# EAGLE design vr-glove-circuit-sch (EAGLE 7.2.0)
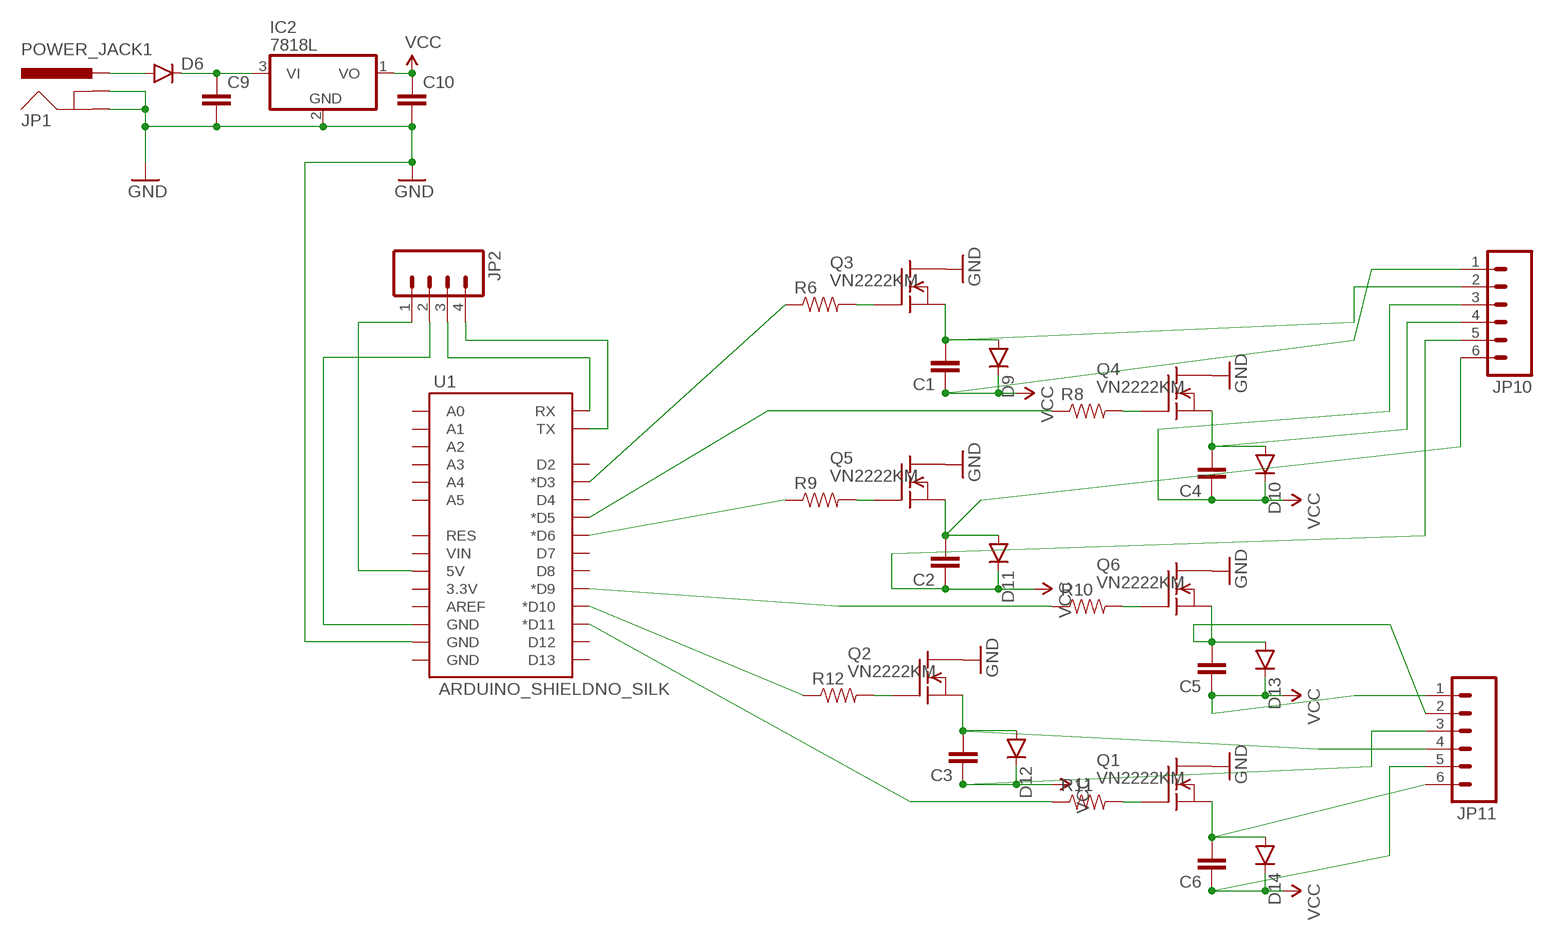
[diagram p0: schematic, sheet 1]

## Parts
C1  CAPPTH  [CAP-PTH-SMALL]
C2  CAPPTH  [CAP-PTH-SMALL]
C3  CAPPTH  [CAP-PTH-SMALL]
C4  CAPPTH  [CAP-PTH-SMALL]
C5  CAPPTH  [CAP-PTH-SMALL]
C6  CAPPTH  [CAP-PTH-SMALL]
C9  CAPPTH  [CAP-PTH-SMALL]
C10  CAPPTH  [CAP-PTH-SMALL]
D6  DIODE1N4148  [DIODE-1N4148]
D9  DIODE1N4148  [DIODE-1N4148]
D10  DIODE1N4148  [DIODE-1N4148]
D11  DIODE1N4148  [DIODE-1N4148]
D12  DIODE1N4148  [DIODE-1N4148]
D13  DIODE1N4148  [DIODE-1N4148]
D14  DIODE1N4148  [DIODE-1N4148]
IC2  7818L  [TO92]
JP1  POWER_JACK1  [POWER_JACK_SMD_OVERPASTE_REDBOARD_0603]
JP2  M04LOCK  [1X04_LOCK]
JP10  M06SILK_FEMALE_PTH  [1X06]
JP11  M06SILK_FEMALE_PTH  [1X06]
Q1  VN2222KM  [TO237]
Q2  VN2222KM  [TO237]
Q3  VN2222KM  [TO237]
Q4  VN2222KM  [TO237]
Q5  VN2222KM  [TO237]
Q6  VN2222KM  [TO237]
R6  RESISTORPTH-1/4W-VERT  [AXIAL-0.1]
R8  RESISTORPTH-1/4W-VERT  [AXIAL-0.1]
R9  RESISTORPTH-1/4W-VERT  [AXIAL-0.1]
R10  RESISTORPTH-1/4W-VERT  [AXIAL-0.1]
R11  RESISTORPTH-1/4W-VERT  [AXIAL-0.1]
R12  RESISTORPTH-1/4W-VERT  [AXIAL-0.1]
U1  ARDUINO_SHIELDNO_SILK  [DUEMILANOVE_VIAS]

## Nets
GND: C9.2 C10.2 IC2.2(GND) JP1.GND(GNDBREAK) JP1.P$4(GND) Q1.1(D) Q2.1(D) Q3.1(D) Q4.1(D) Q5.1(D) Q6.1(D) U1.GND@1(GND)
N$1: Q3.2(G) R6.P$2
N$2: C1.2 D9.A JP10.2 Q3.3(S)
N$3: JP2.2 U1.GND@2(GND)
N$4: Q5.2(G) R9.P$2
N$5: C2.2 D11.A JP10.6 Q5.3(S)
N$6: JP2.1 U1.5V
N$7: Q2.2(G) R12.P$2
N$8: C3.2 D12.A JP11.4 Q2.3(S)
N$9: D6.A JP1.VIN0(PWR)
N$10: Q4.2(G) R8.P$2
N$11: C4.2 D10.A JP10.4 Q4.3(S)
N$12: JP2.3 U1.RX
N$13: Q6.2(G) R10.P$2
N$14: C5.2 D13.A JP11.2 Q6.3(S)
N$15: JP2.4 U1.TX
N$16: Q1.2(G) R11.P$2
N$17: C6.2 D14.A JP11.6 Q1.3(S)
N$18: C9.1 D6.C IC2.3(VI)
N$19: R6.P$1 U1.D3(*D3)
N$20: R8.P$1 U1.D5(*D5)
N$21: R9.P$1 U1.D6(*D6)
N$22: R10.P$1 U1.D9(*D9)
N$23: R12.P$1 U1.D10(*D10)
N$24: R11.P$1 U1.D11(*D11)
VCC: C1.1 C2.1 C3.1 C4.1 C5.1 C6.1 C10.1 D9.C D10.C D11.C D12.C D13.C D14.C IC2.1(VO) JP10.1 JP10.3 JP10.5 JP11.1 JP11.3 JP11.5
Unconnected: U1.3.3V U1.A0 U1.A1 U1.A2 U1.A3 U1.A4 U1.A5 U1.AREF U1.D2 U1.D4 U1.D7 U1.D8 U1.D12 U1.D13 U1.GND@0(GND) U1.RES U1.VIN

## Library data of the parts
C1-C6 = SparkFun-Capacitors:CAP: Capacitor Standard 0603 ceramic capacitor, and 0.1" leaded capacitor.
C9 C10 = SparkFun-Passives:CAP: Capacitor Standard 0603 ceramic capacitor, and 0.1" leaded capacitor.
D6 D9-D14 = SparkFun-DiscreteSemi:DIODE: Diode These are standard reverse protection diodes and small signal diodes. SMA package can handle up to about 1A. SOD-323 can handle about 200mA. What the SOD-323 package when ordering, there are some mfgs out there that are 5-pin packages.
IC2 = linear:78*: Positive VOLTAGE REGULATOR Source: http://cache.national.com/ds/LM/LM78L05.pdf http://www.fairchildsemi.com/ds/LM/LM7805.pdf
JP1 = SparkFun-Connectors:POWER_JACK: Power Jack This is the standard 5.5mm barrel jack for power. The PTH is the most common, proven, reliable, footprint. The Slot footprint only works if the mill layer is transmitted to the PCB fab house so be warned. Mating wall wart : TOL-00298 (and others)
JP2 = SparkFun-Connectors:M04: Header 4 Standard 4-pin 0.1" header. Use with straight break away headers (SKU : PRT-00116), right angle break away headers (PRT-00553), swiss pins (PRT-00743), machine pins (PRT-00117), and female headers (PRT-00115). Molex polarized connector foot print use with SKU : PRT-08231 with associated crimp pins and housings. 1MM SMD Version SKU: PRT-10208
JP10 JP11 = SparkFun-Connectors:M06: Header 6 Standard 6-pin 0.1" header. Use with straight break away headers (SKU : PRT-00116), right angle break away headers (PRT-00553), swiss pins (PRT-00743), machine pins (PRT-00117), and female headers (PRT-00115). Molex polarized connector foot print use with SKU : PRT-08094 with associated crimp pins and housings. NOTES ON THE VARIANTS LOCK and LOCK_LONGPADS... This footprint was designed to help hold the alignment of a through-hole component (i.e. 6-pin header) while soldering it into place. You may notice that each hole has been shifted either up or down by 0.005 of an inch from it's more standard position (which is a perfectly straight line). This slight alteration caused the pins (the squares in the middle) to touch the edges of the holes. Because they are alternating, it causes a "brace" to hold the component in place. 0.005 has proven to be the perfect amount of "off-center" position when using our standard breakaway headers. Although looks a little odd when you look at the bare footprint, once you have a header in there, the alteration is very hard to notice. Also,if you push a header all the way into place, it is covered up entirely on the bottom side. This idea of altering the position of holes to aid alignment will be further integrated into the Sparkfun Library for other footprints. It can help hold any component with 3 or more connection pins.; PROD_ID: CONN-08437
Q1-Q6 = transistor-fet:VN2222KM: N-Channel Enhancement MOSFET (VMOS); 60V; 0,5A; 7,5Ohm
R6 R8-R12 = SparkFun-Resistors:RESISTOR: Resistor Basic schematic elements and footprints for 0603, 1206, and PTH resistors.
U1 = SparkFun-Boards:ARDUINO_SHIELD: Arduino shield footprint

## Board
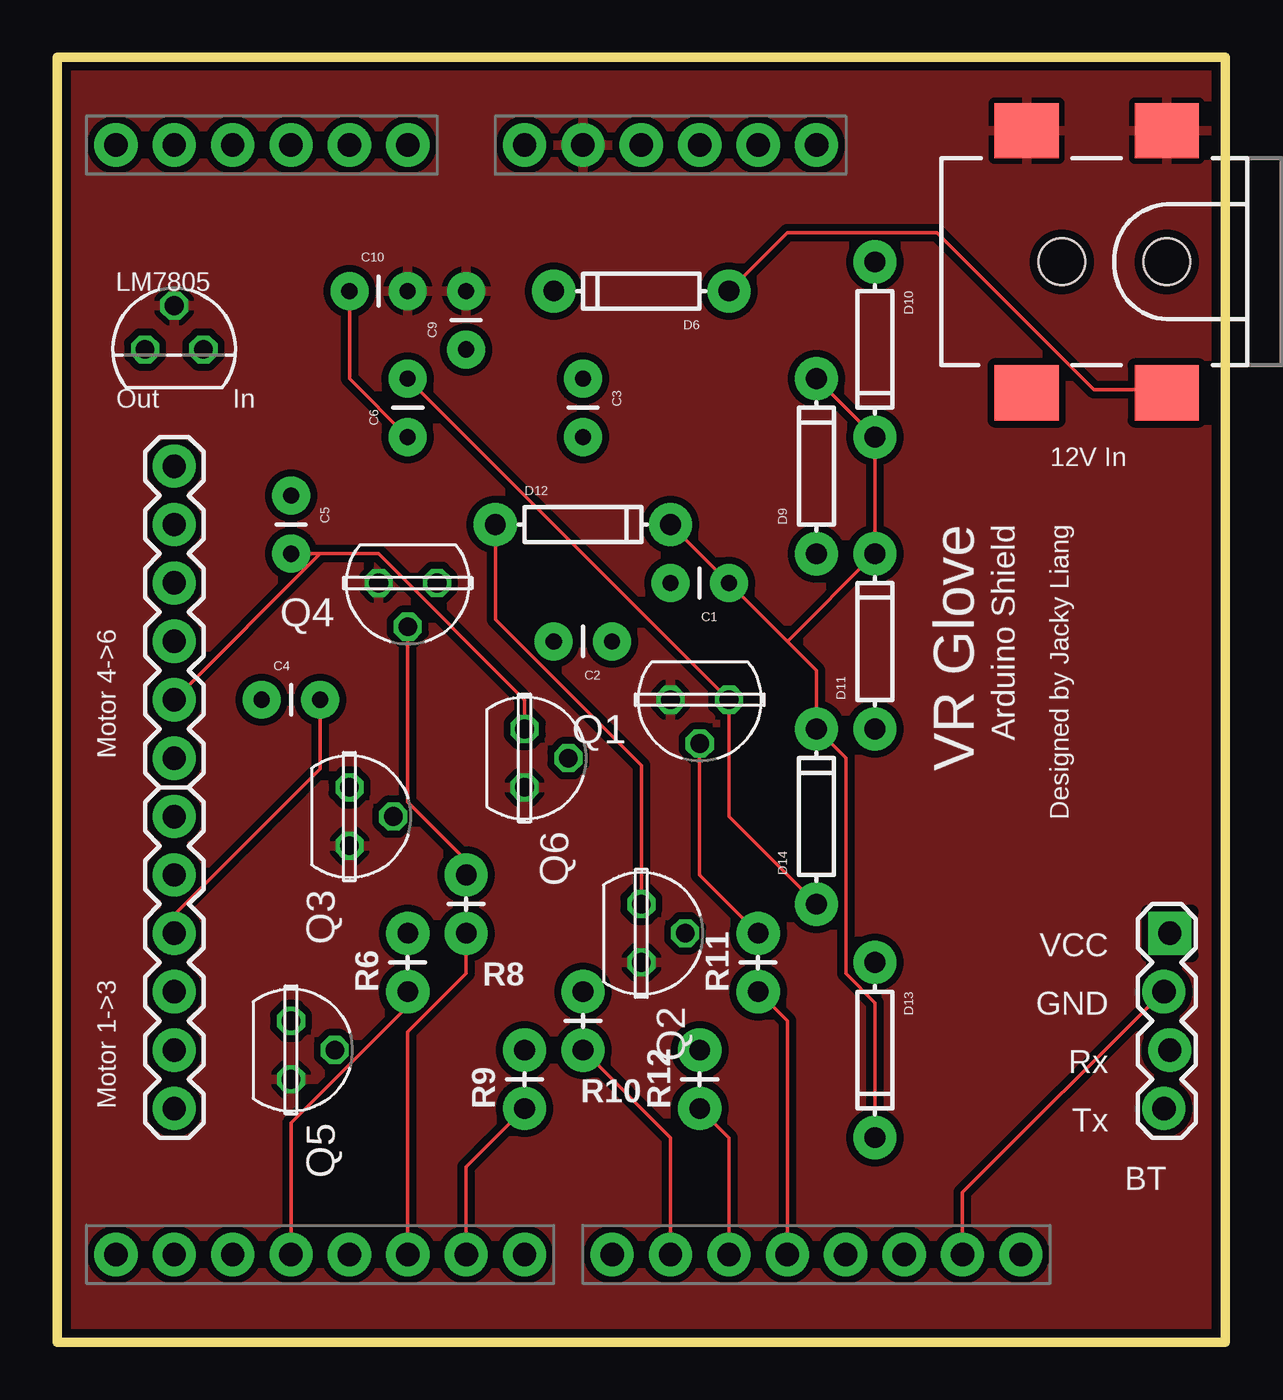
[diagram p1: board, top side]
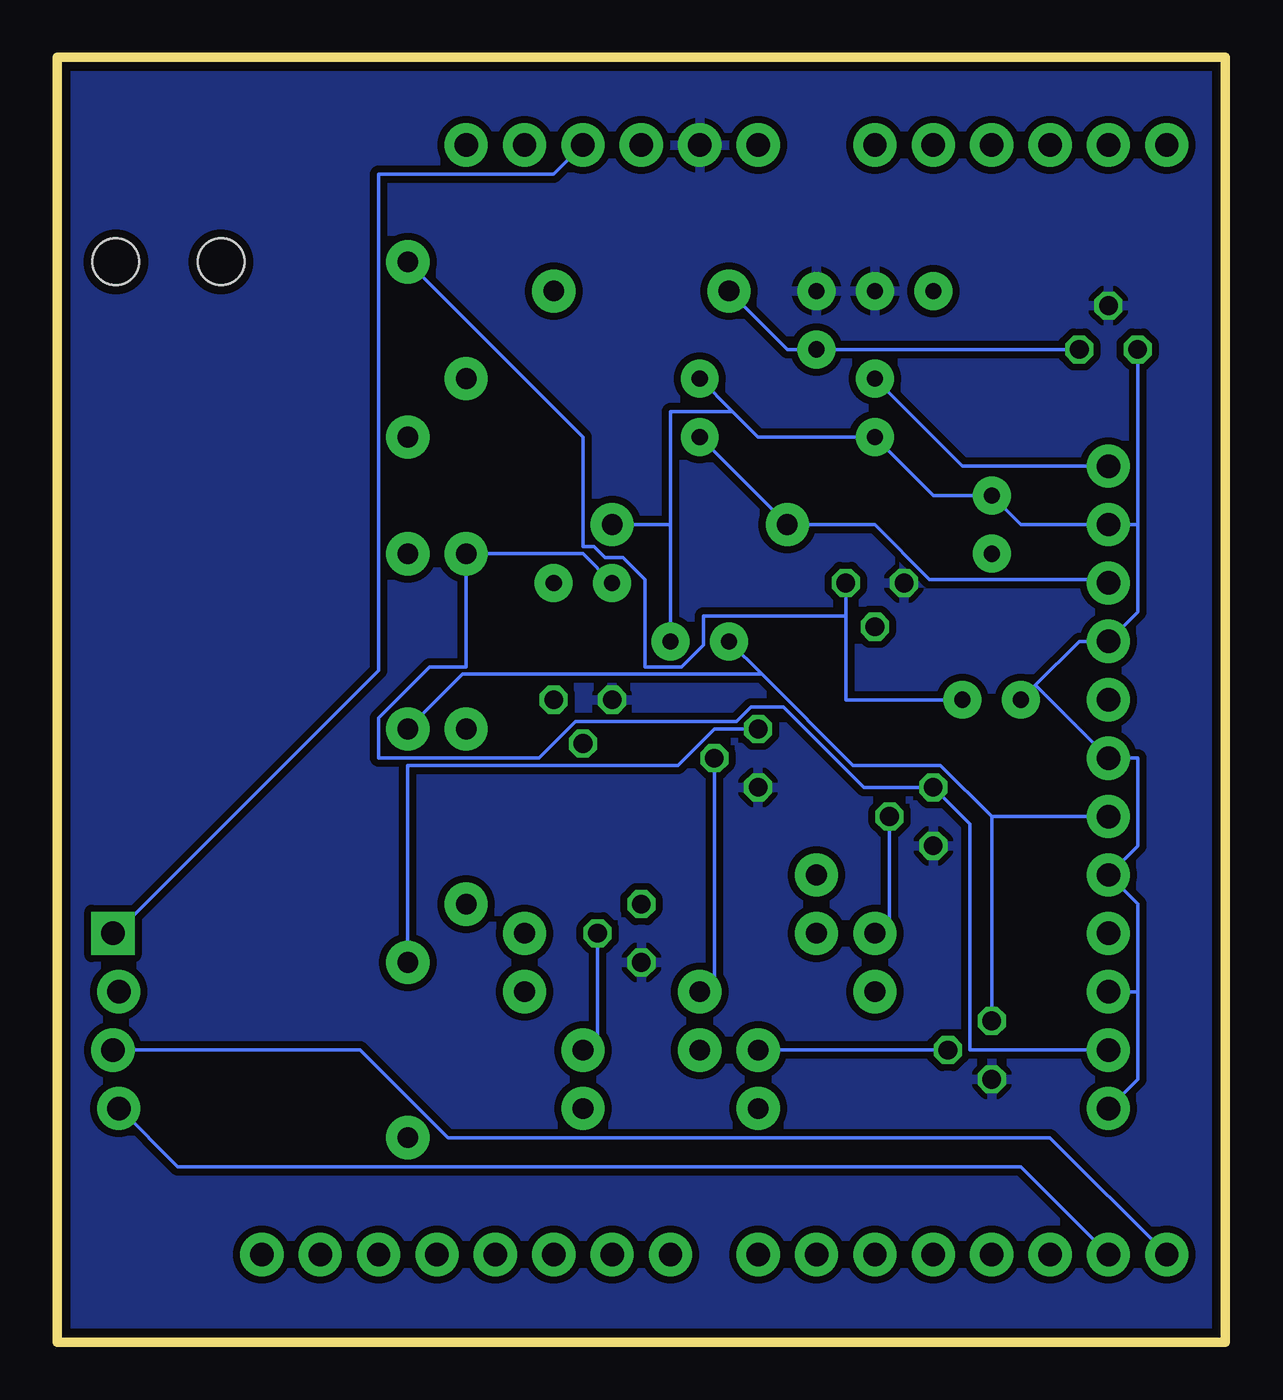
[diagram p2: board, bottom side, seen from below]

Size 50.8 x 55.88 mm. Coordinates in mm from the lower left corner, seen from the top.
Outline: 0,0 50.8,0 50.8,55.88 0,55.88 0,0
Copper layers (1*16): Top 0.0356mm / dielectric 1.5011mm / Bottom 0.0356mm
Design rules "LaenPCBOrder": minimum track width 6mil, minimum drill 13mil, track to track 6mil, track to pad 6mil, pad to pad 6mil, via to via 6mil, smd to smd 6mil, copper to edge 15mil, drill to drill 6mil, minimum pad ring 7mil, minimum via ring 7mil, stop-mask expansion 4mil, vias tented up to drill 0mil, thermal gap 10mil

### Footprints (pad centres in the part's own frame; a part is rotated, then mirrored left to right if it is on the bottom)
CAP-PTH-SMALL = drill 0.7 pad 1.651: 1 0,0; 2 2.54,0
DIODE-1N4148 = drill 0.9 pad 1.88: A -3.81,0; C 3.81,0
TO92 = drill 0.813 octagon: 1 -1.27,0; 2 0,1.905; 3 1.27,0
POWER_JACK_SMD_OVERPASTE_REDBOARD_0603 = smd 2.8 x 2.4: GND 0,-5.7; P$4 6.1,-5.7; VIN0 0,5.7; VIN1 6.1,5.7 | hole 2.032: 0,0; 4.572,0
1X04_LOCK = drill 1.016 pad 1.88 square: 1 0,0.127 | drill 1.016 pad 1.88: 2 2.54,-0.127; 3 5.08,0.127; 4 7.62,-0.127
1X06 = drill 1.016 pad 1.88: 1 0,0; 2 2.54,0; 3 5.08,0; 4 7.62,0; 5 10.16,0; 6 12.7,0
TO237 = drill 0.813 octagon: 1 1.27,0; 2 0,1.905; 3 -1.27,0
AXIAL-0.1 = drill 0.9 pad 1.88: P$1 0,0; P$2 2.54,0
DUEMILANOVE_VIAS = drill 1.016 pad 1.88: 3.3V 50.8,13.97; 5V 50.8,16.51; A0 50.8,29.21; A1 50.8,31.75; A2 50.8,34.29; A3 50.8,36.83; A4 50.8,39.37; A5 50.8,41.91; AREF 2.54,2.54; D2 2.54,36.83; D3 2.54,34.29; D4 2.54,31.75; D5 2.54,29.21; D6 2.54,26.67; D7 2.54,24.13; D8 2.54,20.32; D9 2.54,17.78; D10 2.54,15.24; D11 2.54,12.7; D12 2.54,10.16; D13 2.54,7.62; GND@0 50.8,19.05; GND@1 50.8,21.59; GND@2 2.54,5.08; RES 50.8,11.43; RX 2.54,41.91; TX 2.54,39.37; VIN 50.8,24.13

### Placement (x,y rotation side)
C1  29.21,33.02 180 top
C2  24.13,30.48 180 top
C3  22.86,41.91 270 top
C4  8.89,27.94 0 top
C5  10.16,36.83 270 top
C6  15.24,39.37 90 top
C9  17.78,43.18 90 top
C10  12.7,45.72 0 top
D6  25.4,45.72 180 top
D9  33.02,38.1 90 top
D10  35.56,43.18 270 top
D11  35.56,30.48 90 top
D12  22.86,35.56 0 top
D13  35.56,12.7 270 top
D14  33.02,22.86 90 top
IC2  5.08,43.18 0 top
JP1  48.26,46.99 180 top
JP2  48.26,17.78 270 top
JP10  5.08,10.16 90 top
JP11  5.08,25.4 90 top
Q1  27.94,27.94 180 top
Q2  25.4,17.78 270 top
Q3  12.7,22.86 270 top
Q4  15.24,33.02 180 top
Q5  10.16,12.7 270 top
Q6  20.32,25.4 270 top
R6  15.24,15.24 90 top
R8  17.78,17.78 90 top
R9  20.32,10.16 90 top
R10  22.86,12.7 90 top
R11  30.48,15.24 90 top
R12  27.94,10.16 90 top
U1  44.45,1.27 90 top

### Tracks (layer width: path | path; a pad name or v marks a point on that pad's centre or on a via)
GND
  pour Top (isolate 0.305): 0,55.88 50.8,55.88 50.8,0 0,0
  pour Bottom (isolate 0.305): 0,55.88 50.8,55.88 50.8,0 0,0
N$1
  Bottom 0.152: Q3.2 14.6,17.78 R6.P$2
N$2
  Bottom 0.152: C1.2 27.94,34.29 D9.A 33.02,29.37 34.61,29.37 36.83,27.15 36.83,25.4 29.84,25.4 28.26,26.99 21.27,26.99 20.64,27.62 19.21,27.62 15.72,24.13 Q3.3 11.11,22.54 11.11,12.7 JP10.2
N$3
  Top 0.152: U1.GND@2 39.37,6.51 48.1,15.24 JP2.2
N$4
  Bottom 0.152: R9.P$2 Q5.2
N$5
  Bottom 0.152: 10.16,22.86 Q5.3 | JP10.6 10.16,22.86 | 20.16,29.05 16.19,25.08 12.38,25.08 10.16,22.86 | 20.16,29.05 C2.2 | D11.A 33.18,29.05 20.16,29.05
N$6
  Bottom 0.152: U1.5V 29.21,50.8 36.83,50.8 36.83,29.21 48.26,17.78 JP2.1
N$7
  Bottom 0.152: Q2.2 27.3,12.7 R12.P$2
N$8
  Top 0.152: Q2.3 25.4,25.08 19.05,31.43 D12.A
  Bottom 0.152: C3.2 D12.A 15.24,35.56 12.86,33.18 5.24,33.18 JP11.4
N$9
  Top 0.152: D6.A 31.75,48.26 38.26,48.26 45.09,41.43 48.26,41.43 JP1.VIN0
N$10
  Top 0.152: Q4.2 15.24,23.49 17.78,20.95 R8.P$2
N$11
  Top 0.152: JP10.4 5.08,18.57 11.43,24.92 C4.2
  Bottom 0.152: 16.51,31.59 16.51,27.94 C4.2 | 16.51,31.59 Q4.3 | D10.A 27.94,39.37 27.94,34.61 27.46,34.61 26.99,34.13 26.19,34.13 25.24,33.18 25.24,29.37 23.65,29.37 22.7,30.32 22.7,31.59 16.51,31.59
N$12
  Bottom 0.152: U1.RX 7.62,8.89 33.81,8.89 37.62,12.7 JP2.3
N$13
  Bottom 0.152: Q6.2 22.23,15.24 R10.P$2
N$14
  Top 0.152: Q6.3 20.32,27.94 13.97,34.29 11.43,34.29 | C5.2 11.43,34.29 | 11.43,34.29 JP11.2
  Bottom 0.152: D13.A 35.56,25.08 23.81,25.08 22.23,26.67 Q6.3
N$15
  Bottom 0.152: U1.TX 8.89,7.62 45.56,7.62 48.1,10.16 JP2.4
N$16
  Top 0.152: Q1.2 27.94,20.32 R11.P$2
N$17
  Top 0.152: D14.A 29.21,22.86 Q1.3 C6.2
  Bottom 0.152: C6.2 11.43,38.1 JP11.6
N$18
  Bottom 0.152: IC2.3 C9.1 19.05,43.18 D6.C
N$19
  Top 0.152: U1.D3 10.16,9.52 15.24,14.6 R6.P$1
N$20
  Top 0.152: U1.D5 15.24,13.49 17.78,16.03 R8.P$1
N$21
  Top 0.152: U1.D6 17.78,7.62 R9.P$1
N$22
  Top 0.152: U1.D9 26.67,8.89 R10.P$1
N$23
  Top 0.152: U1.D10 29.21,8.89 R12.P$1
N$24
  Top 0.152: U1.D11 31.75,13.97 R11.P$1
VCC
  Top 0.152: 35.61,34.39 D11.C | 35.61,39.27 D10.C | D10.C D9.C | D11.C D10.C | D12.C C1.1 31.75,30.48 | 31.75,30.48 33.02,29.21 D14.C 34.29,25.4 34.29,16.03 35.56,14.76 D13.C | 31.75,30.48 D11.C | C10.1 12.7,41.91 C6.1
  Bottom 0.152: 24.13,35.56 C2.1 | D12.C 24.13,35.56 | JP10.1 3.81,11.43 3.81,15.24 | JP10.3 3.81,15.24 | 3.81,15.24 3.81,19.05 JP10.5 3.81,21.59 3.81,25.4 JP11.1 8.25,28.58 | 8.25,28.58 6.35,30.48 JP11.3 3.81,31.75 3.81,35.56 | 8.25,28.58 C4.1 | 3.81,35.56 IC2.1 | 3.81,35.56 JP11.5 8.89,35.56 C5.1 12.7,36.83 C6.1 20.32,39.37 21.43,40.48 | 21.43,40.48 C3.1 | 24.13,35.56 24.13,40.48 21.43,40.48

### Text on the board
tPlace: LM7805 | Out | In | 12V In | VR Glove | Arduino Shield | Designed by Jacky Liang | Motor 4->6 | VCC | GND | Rx | Motor 1->3 | Tx | BT